# EAGLE schematic Progetto-Robot (EAGLE 9.6.2)
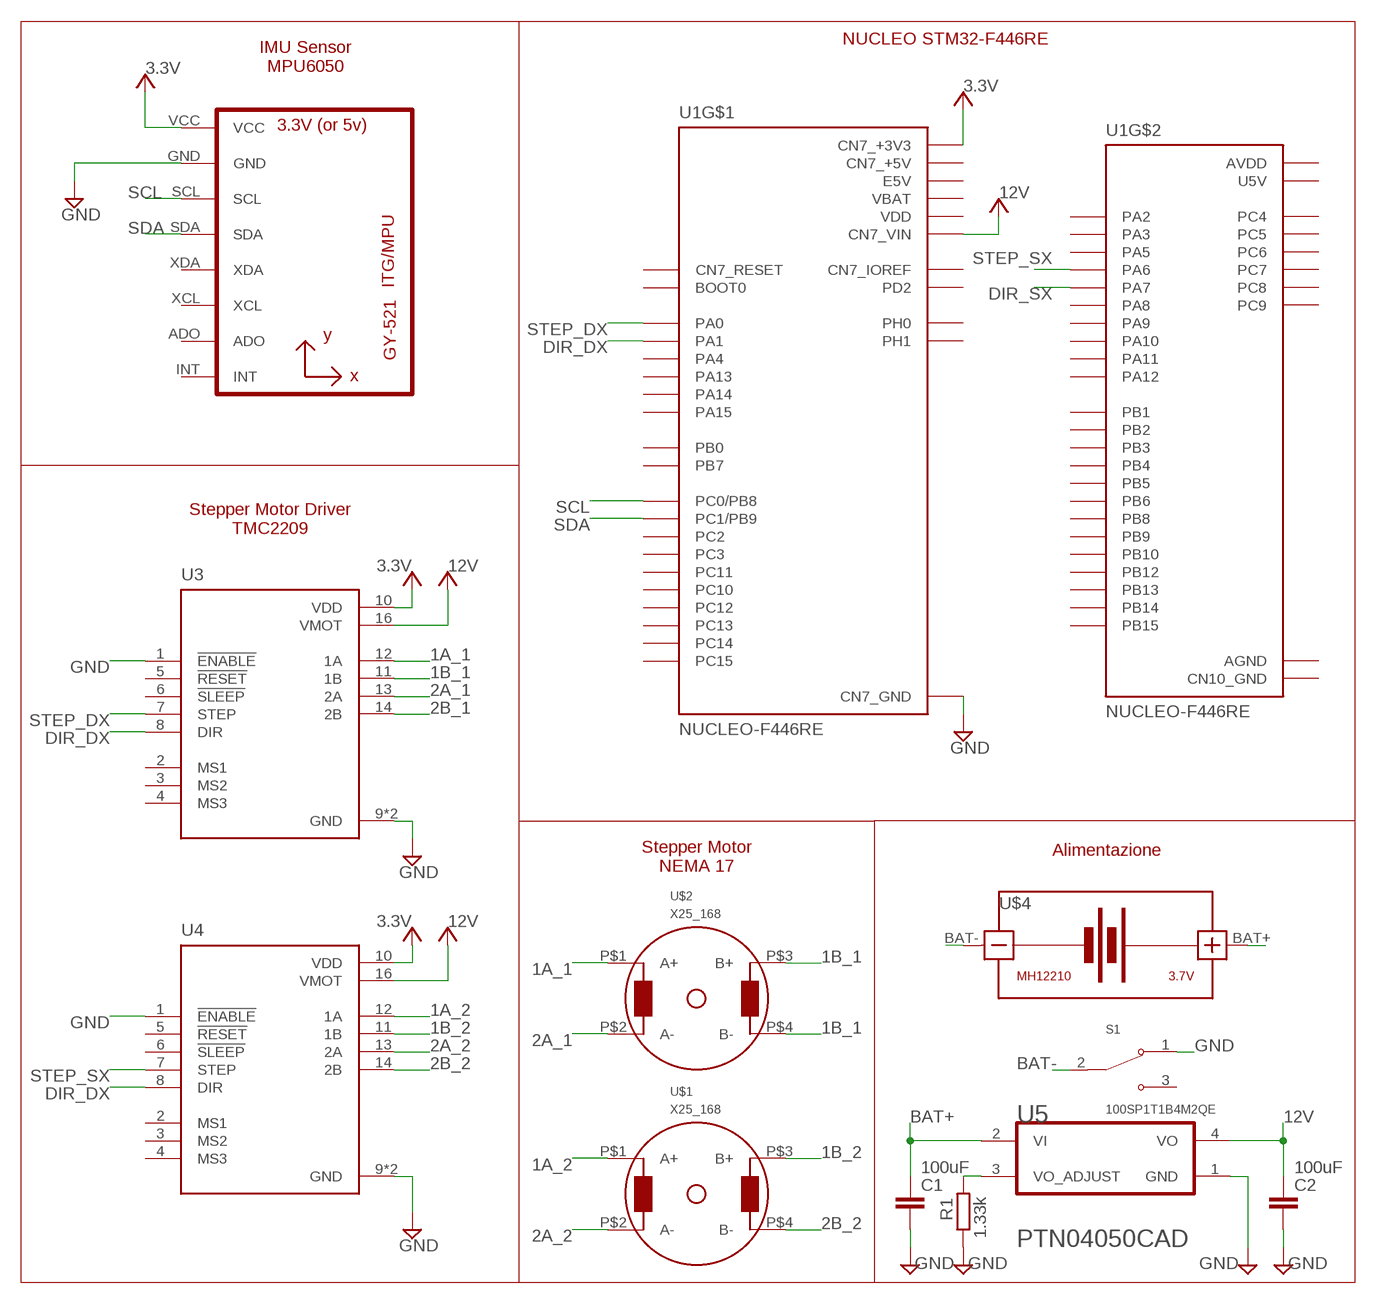
[diagram p0: schematic, sheet 1]

## Parts
C1  100uF  C-EU050-024X044  [C050-024X044]
C2  100uF  C-EU050-024X044  [C050-024X044]
R1  1.33k  R-EU_0207/10  [0207/10]
S1  100SP1T1B4M2QE  [SW_100SP1T1B4M2QE]
U1  NUCLEO-F446RE  [MODULE_NUCLEO-F446RE]
U2  GY-521MPU6050  [GY-521]
U3  A4988_STEPPER_MOTOR_DRIVER_CARRIER  [MODULE_A4988_STEPPER_MOTOR_DRIVER_CARRIER]
U4  A4988_STEPPER_MOTOR_DRIVER_CARRIER  [MODULE_A4988_STEPPER_MOTOR_DRIVER_CARRIER]
U5  TEXAS_INSTRUMENTS_PTN04050CADTEXAS_INSTRUMENTS_PTN04050CAD_0_0  [TEXAS_INSTRUMENTS_PTN04050CAD_0]
U$1  X25_168  [X25_168]
U$2  X25_168  [X25_168]
U$4  BATTERY-LI-MH12210  [BATTERY-LI-MH12210]

## Nets
1A_1: U3.12(1A) U$2.P$1(A+)
1A_2: U4.12(1A) U$1.P$1(A+)
1B_1: U3.11(1B) U$2.P$3(B+) U$2.P$4(B-)
1B_2: U4.11(1B) U$1.P$3(B+)
2A_1: U3.13(2A) U$2.P$2(A-)
2A_2: U4.13(2A) U$1.P$2(A-)
2B_1: U3.14(2B)
2B_2: U4.14(2B) U$1.P$4(B-)
3.3V: U2.VCC U3.10(VDD) U4.10(VDD) ; supply symbol labelled VCC
12V: C2.1 U1.CN7_24(CN7_VIN) U3.16(VMOT) U4.16(VMOT) U5.4(VO) ; supply symbol labelled VCC
BAT+: C1.1 U5.2(VI) U$4.BAT+
BAT-: S1.2 U$4.BAT-
DIR_DX: U1.CN7_30(PA1) U3.8(DIR) U4.8(DIR)
DIR_SX: U1.CN10_15(PA7)
GND: C1.2 C2.2 R1.1 S1.1 U1.CN7_8(CN7_GND) U1.CN7_19(CN7_GND) U1.CN7_20(CN7_GND) U1.CN7_22(CN7_GND) U2.GND U3.1(!ENABLE) U3.9(GND) U3.15(GND) U4.1(!ENABLE) U4.9(GND) U4.15(GND) U5.1(GND)
N$1: U1.CN7_16(CN7_+3V3)
N$2: R1.2 U5.3(VO_ADJUST)
SCL: U1.CN7_38(PC0/PB8) U2.SCL
SDA: U1.CN7_36(PC1/PB9) U2.SDA
STEP_DX: U1.CN7_28(PA0) U3.7(STEP)
STEP_SX: U1.CN10_13(PA6) U4.7(STEP)
Unconnected: S1.3 U1.CN5_1(D8) U1.CN5_2(D9) U1.CN5_3(D10) U1.CN5_4(D11) U1.CN5_5(D12) U1.CN5_6(D13) U1.CN5_9(D14) U1.CN5_10(D15) U1.CN6_2(CN6_IOREF) U1.CN6_3(CN6_RESET) U1.CN7_1(PC10) U1.CN7_2(PC11) U1.CN7_3(PC12) U1.CN7_4(PD2) U1.CN7_7(BOOT0) U1.CN7_12(CN7_IOREF) U1.CN7_13(PA13) U1.CN7_14(CN7_RESET) U1.CN7_15(PA14) U1.CN7_17(PA15) U1.CN7_21(PB7) U1.CN7_23(PC13) U1.CN7_25(PC14) U1.CN7_27(PC15) U1.CN7_29(PH0) U1.CN7_31(PH1) U1.CN7_32(PA4) U1.CN7_34(PB0) U1.CN7_35(PC2) U1.CN7_37(PC3) U1.CN8_1(A0) U1.CN8_2(A1) U1.CN8_3(A2) U1.CN8_4(A3) U1.CN8_5(A4) U1.CN8_6(A5) U1.CN9_1(D0) U1.CN9_2(D1) U1.CN9_3(D2) U1.CN9_4(D3) U1.CN9_5(D4) U1.CN9_6(D5) U1.CN9_7(D6) U1.CN9_8(D7) U1.CN10_1(PC9) U1.CN10_2(PC8) U1.CN10_3(PB8) U1.CN10_4(PC6) U1.CN10_5(PB9) U1.CN10_6(PC5) U1.CN10_11(PA5) U1.CN10_12(PA12) U1.CN10_14(PA11) U1.CN10_16(PB12) U1.CN10_17(PB6) U1.CN10_19(PC7) U1.CN10_21(PA9) U1.CN10_22(PB2) U1.CN10_23(PA8) U1.CN10_24(PB1) U1.CN10_25(PB10) U1.CN10_26(PB15) U1.CN10_27(PB4) U1.CN10_28(PB14) U1.CN10_29(PB5) U1.CN10_30(PB13) U1.CN10_31(PB3) U1.CN10_33(PA10) U1.CN10_34(PC4) U1.CN10_35(PA2) U1.CN10_37(PA3) U2.ADO U2.INT U2.XCL U2.XDA U3.2(MS1) U3.3(MS2) U3.4(MS3) U3.5(!RESET) U3.6(!SLEEP) U4.2(MS1) U4.3(MS2) U4.4(MS3) U4.5(!RESET) U4.6(!SLEEP)

## Notes on the sheet
- NUCLEO STM32-F446RE
- IMU Sensor
  MPU6050
- Stepper Motor Driver
  TMC2209
- Stepper Motor
  NEMA 17
- Alimentazione

## Power pins joined to a net without a drawn wire
AGND: U1.CN10_32(AGND)
AREF: U1.CN5_8(AREF)
AVDD: U1.CN10_7(AVDD)
CN5_GND: U1.CN5_7(CN5_GND)
CN6_+3V3: U1.CN6_4(CN6_+3V3)
CN6_+5V: U1.CN6_5(CN6_+5V)
CN6_GND: U1.CN6_6(CN6_GND) U1.CN6_7(CN6_GND)
CN6_VIN: U1.CN6_8(CN6_VIN)
CN7_+5V: U1.CN7_18(CN7_+5V)
CN10_GND: U1.CN10_9(CN10_GND) U1.CN10_20(CN10_GND)
E5V: U1.CN7_6(E5V)
U5V: U1.CN10_8(U5V)
VBAT: U1.CN7_33(VBAT)
VDD: U1.CN7_5(VDD)

## Library data of the parts
C1 C2 = rcl:C-EU: CAPACITOR, European symbol; SPICEPREFIX: C
R1 = rcl:R-EU_: RESISTOR, European symbol; SPICEPREFIX: R
S1 = spdt_toggle_switch:100SP1T1B4M2QE: Toggle Switch SPDT Through Hole Check prices <https://pricing.snapeda.com/parts/100SP1T1B4M2QE/E-Switch/view-part?ref=eda>; AVAILABILITY: In Stock; DESCRIPTION: Toggle Switch SPDT Through Hole; MF: E-Switch; MP: 100SP1T1B4M2QE; PACKAGE: None; PRICE: None
U1 = NUCLEO-F446RE:NUCLEO-F446RE: STM32 Nucleo-64 development board with STM32F446RET6 MCU, supports Arduino and ST morpho connectivity Check prices <https://pricing.snapeda.com/parts/NUCLEO-F446RE/STMicroelectronics/view-part?ref=eda>; AVAILABILITY: In Stock; DESCRIPTION: STM32F446RE, mbed-Enabled Development Nucleo-64 STM32F4 ARM® Cortex®-M4 MCU 32-Bit Embedded Evaluation Board; MF: STMicroelectronics; MP: NUCLEO-F446RE; PACKAGE: None; PRICE: None
U2 = gy-521:GY-521
U3 U4 = TMC2209:A4988_STEPPER_MOTOR_DRIVER_CARRIER: Stepper motor controler; IC: A4988; 1A; Uin mot: 8÷35V Check prices <https://pricing.snapeda.com/parts/A4988%20STEPPER%20MOTOR%20DRIVER%20CARRIER/Pololu/view-part?ref=eda>; AVAILABILITY: No availability data; DESCRIPTION: Stepper Motor Driver; MF: Pololu; MP: A4988 STEPPER MOTOR DRIVER CARRIER; PACKAGE: None; PRICE: None
U5 = Texas Instruments - PTN04050CAD:TEXAS_INSTRUMENTS_PTN04050CAD: TI-PTN04050CEUX4; CIIVA_IDS: 13604905; COMPONENT_LINK_1_DESCRIPTION: Manufacturer URL; COMPONENT_LINK_1_URL: http://www.ti.com/; COMPONENT_LINK_3_DESCRIPTION: Package Specification; COMPONENT_LINK_3_URL: http://www.ti.com/litv/pdf/mpds218a; COMPONENT_LINK_4_DESCRIPTION: URL Link1; COMPONENT_LINK_4_URL: Samples URL:http://www.ti.com/product/ptn04050c#samples; DATASHEET: http://www.ti.com/general/docs/lit/getliterature.tsp?genericPartNumber=PTN04050C&fileType=pdf; DATASHEET_VERSION: SLTS251A; FOOTPRINT_VARIANT_NAME_0: Manufacturer Recommended; IMPORTED: yes; IMPORTED_FROM: vault; IMPORT_TS: 1521860687; IOUT_MAX_A: 2.4; MF: Texas Instruments; MOUNTING_TECHNOLOGY: Through Hole; MPN: PTN04050CAD; PACKAGE: EUU0004A; PACKAGE_DESCRIPTION: 4-Pin Plastic Special Shape, Body 12.57 x 22.1 mm; PACKAGE_VERSION: 4205246-2/C; PREFIX: U; REGULATED_OUTPUTS: 1; RELEASE_DATE: 1464587343; ROHS: Yes; SUB_FAMILY: Non-Isolated POL; VAULT_GUID: DA6968FB-FE78-4DD7-AF8A-6C7172F690AD; VAULT_REVISION: DDF7F1F6-1181-4A13-8779-1B6643FDE1F6; VIN_MAX_V: 5.5; VIN_MIN_V: 2.95; VOUT_MAX_V: 15; VOUT_MIN_V: 5; VO_ADJUSTABLE: true
U$1 U$2 = Stepper:X25_168: X25168 - Miniature stepper motor for analog gauge
U$4 = DIY_libraries:BATTERY-LI-MH12210: Lithium-Ion MH12210 Rechargeable Battery Panasonic NCR18650PF battery datasheet available here: https://industrial.panasonic.com/cdbs/www-data/pdf2/ACI4000/ACI4000C12.pdf Click here to find device on ebay.com <http://www.ebay.com/sch/ncr18650b+battery>